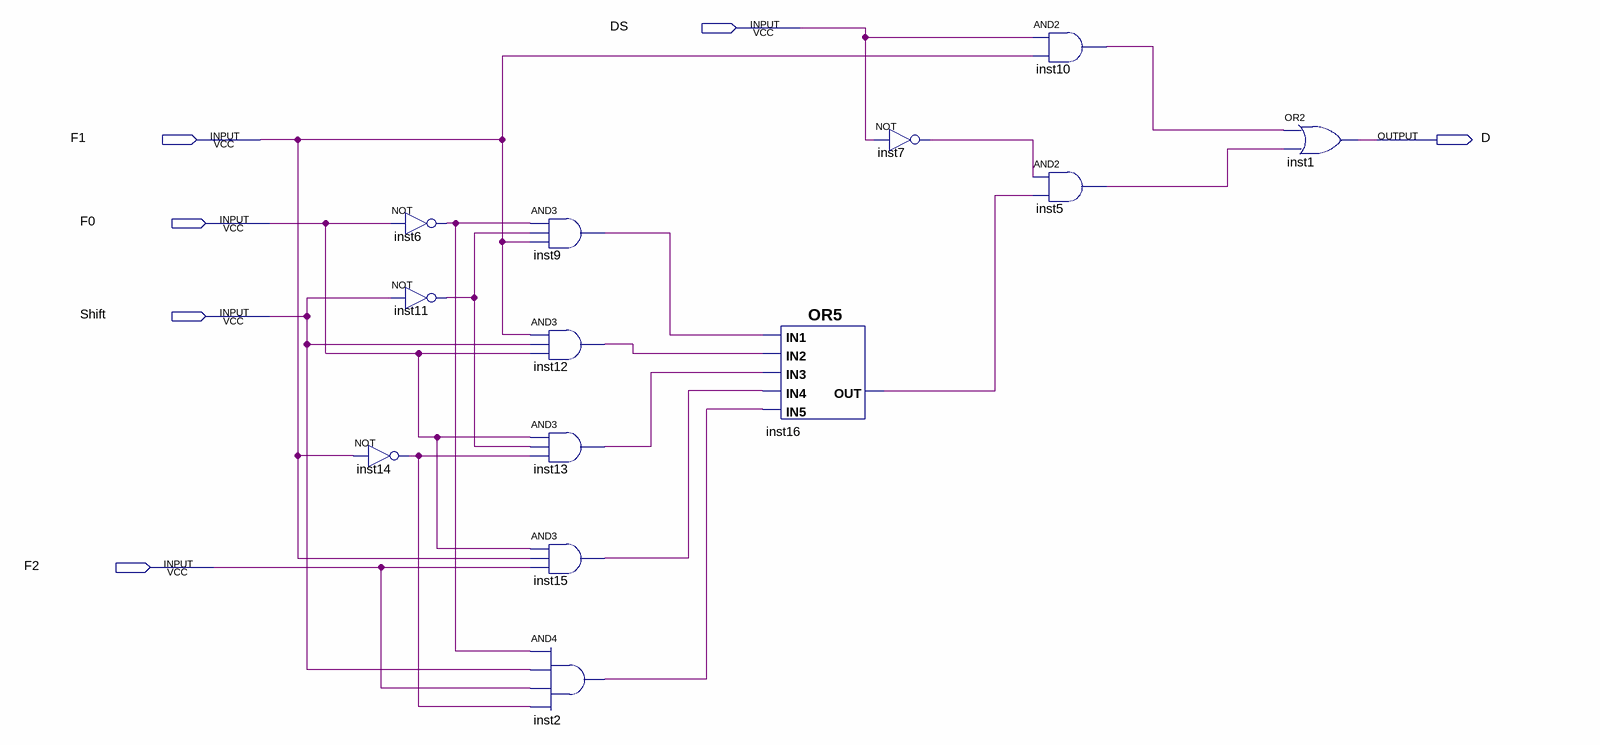
[diagram p0: schematic sheet]
// Quartus schematic entradaFFh1.bdf as structural Verilog: 13 symbols, 6 pins
module entradaFFh1 (
  input  DS,
  input  F1,
  input  F0,
  input  Shift,
  input  F2,
  output D
);

  wire inst2_out, inst5_out, inst6_out, inst7_out, inst9_out, inst10_out, inst11_out, inst12_out, inst13_out,
       inst14_out, inst15_out, inst16_out;

  not inst14 (inst14_out, F1);
  not inst6 (inst6_out, F0);
  not inst11 (inst11_out, Shift);
  and inst9 (inst9_out, inst6_out, inst11_out, F1);
  and inst12 (inst12_out, F1, Shift, F0);
  and inst13 (inst13_out, F0, inst11_out, inst14_out);
  and inst15 (inst15_out, F0, F1, F2);
  and inst2 (inst2_out, inst6_out, Shift, F2, inst14_out);
  or inst16 (inst16_out, inst9_out, inst12_out, inst13_out, inst15_out, inst2_out);
  not inst7 (inst7_out, DS);
  and inst10 (inst10_out, DS, F1);
  and inst5 (inst5_out, inst7_out, inst16_out);
  or inst1 (D, inst10_out, inst5_out);
endmodule
